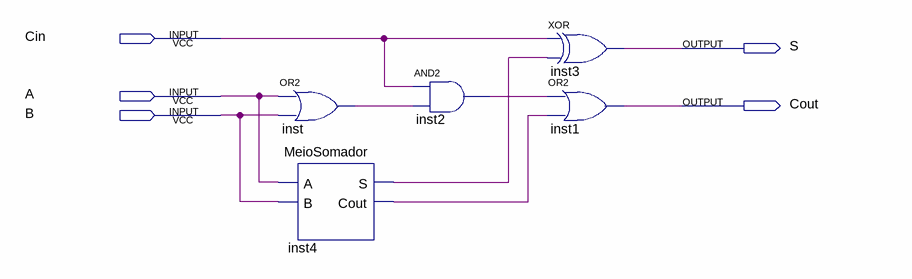
[diagram p0: schematic sheet]
// Quartus schematic SomadorCompleto.bdf as structural Verilog: 5 symbols, 5 pins
module SomadorCompleto (
  input  Cin,
  input  A,
  input  B,
  output S,
  output Cout
);

  wire inst2_out, inst4_cout, inst4_s, inst_out;

  or inst (inst_out, A, B);
  MeioSomador inst4 (.A(A), .B(B), .S(inst4_s), .Cout(inst4_cout));
  and inst2 (inst2_out, Cin, inst_out);
  xor inst3 (S, Cin, inst4_s);
  or inst1 (Cout, inst2_out, inst4_cout);
endmodule
